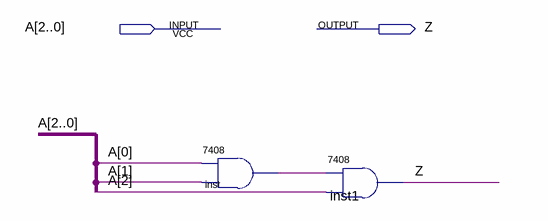
[diagram p0: schematic sheet]
// Quartus schematic and_3in.bdf as structural Verilog: 2 symbols, 2 pins
module and_3in (
  input  [2:0] A,
  output Z
);

  wire inst_1;

  \7408  inst (.\3 (A[1]), .\2 (A[0]), .\1 (inst_1));
  \7408  inst1 (.\3 (A[2]), .\2 (inst_1), .\1 (Z));
endmodule
